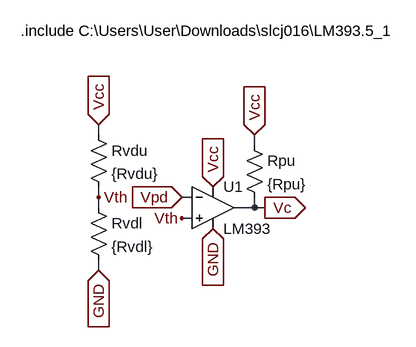
[diagram p0: schematic VolDiv_InvComp.asc]
VolDiv_InvComp.asc, the LTspice schematic file:
Version 4
SHEET 1 880 680
WIRE -48 96 -48 80
WIRE 192 112 192 96
WIRE -48 192 -48 176
WIRE 96 192 80 192
WIRE -48 208 -48 192
WIRE 192 208 192 192
WIRE 192 208 160 208
WIRE 208 208 192 208
WIRE 96 224 80 224
WIRE -48 304 -48 288
FLAG 128 240 GND
IOPIN 128 240 In
FLAG 128 176 Vcc
IOPIN 128 176 In
FLAG 80 192 Vpd
IOPIN 80 192 In
FLAG 80 224 Vth
FLAG 208 208 Vc
IOPIN 208 208 Out
FLAG -48 304 GND
IOPIN -48 304 In
FLAG -48 80 Vcc
IOPIN -48 80 In
FLAG -48 192 Vth
FLAG 192 96 Vcc
IOPIN 192 96 In
SYMBOL OpAmps\\opamp2 128 144 R0
SYMATTR InstName U1
SYMATTR Value LM393
SYMBOL res -64 192 R0
SYMATTR InstName Rvdl
SYMATTR Value {Rvdl}
SYMBOL res -64 80 R0
SYMATTR InstName Rvdu
SYMATTR Value {Rvdu}
SYMBOL res 176 96 R0
SYMATTR InstName Rpu
SYMATTR Value {Rpu}
TEXT -168 -64 Left 2 !.include C:\\Users\\User\\Downloads\\slcj016\\LM393.5_1

The netlist it stands for:
* VolDiv_InvComp.asc
XU1 Vth Vpd Vcc GND Vc LM393  ; pins In+ In- V+ V- OUT
Rvdl Vth GND {Rvdl}
Rvdu Vcc Vth {Rvdu}
Rpu Vcc Vc {Rpu}
.include C:\Users\User\Downloads\slcj016\LM393.5_1
.backanno
.end